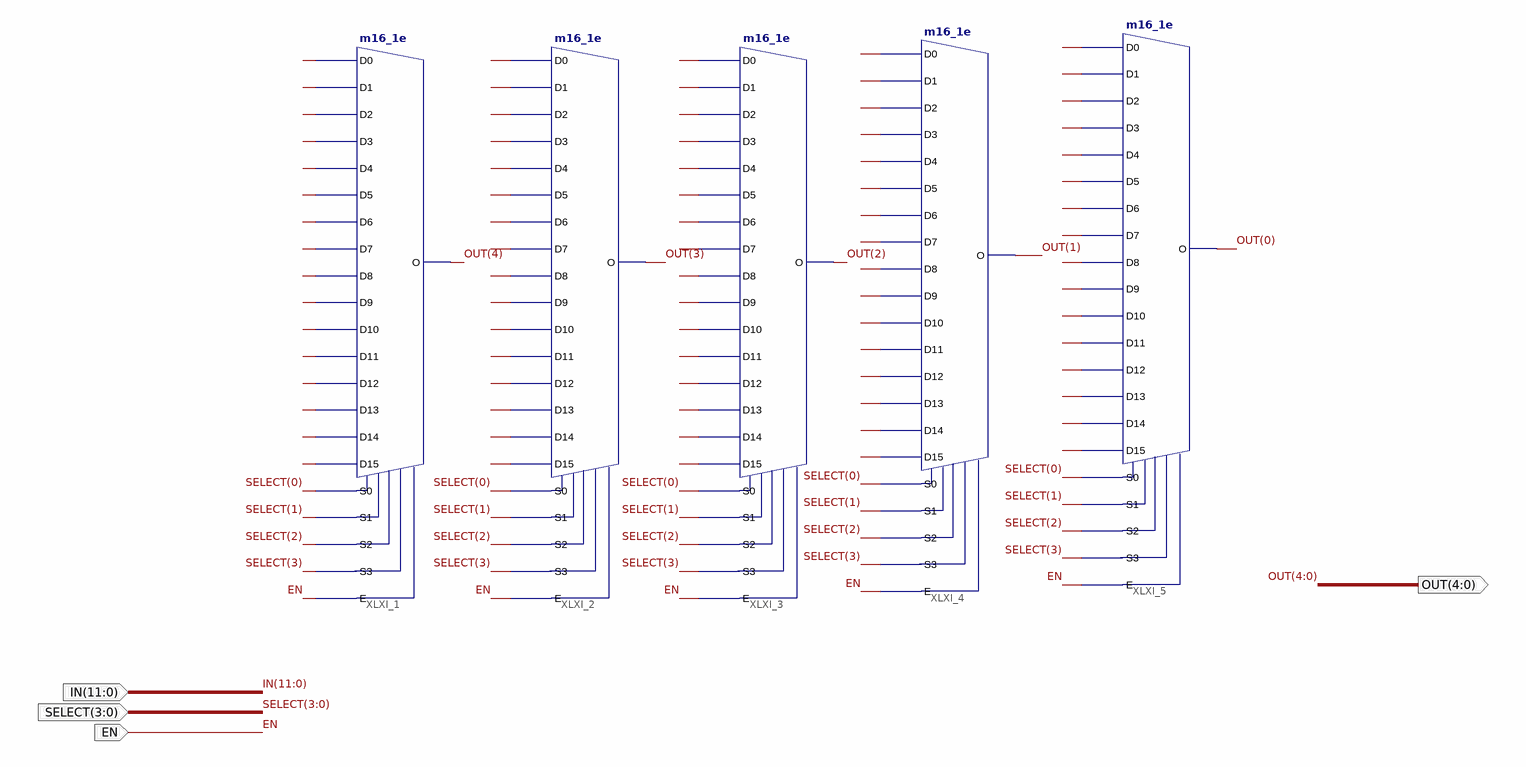
[diagram p0: schematic sheet 1]
// Xilinx ISE schematic eleven_five_mux.sch (spartan3e) as structural Verilog: 5 symbols, 4 ports
module eleven_five_mux (
  input  [3:0] SELECT,
  input  [11:0] IN,
  input  EN,
  output [4:0] OUT
);

  wire XLXN_10, XLXN_11, XLXN_12, XLXN_13, XLXN_14, XLXN_15, XLXN_16, XLXN_17, XLXN_18, XLXN_19, XLXN_21,
       XLXN_22, XLXN_23, XLXN_24, XLXN_25, XLXN_26, XLXN_33, XLXN_34, XLXN_35, XLXN_36, XLXN_37, XLXN_38,
       XLXN_39, XLXN_40, XLXN_41, XLXN_42, XLXN_43, XLXN_44, XLXN_45, XLXN_46, XLXN_47, XLXN_48, XLXN_58,
       XLXN_59, XLXN_60, XLXN_61, XLXN_62, XLXN_63, XLXN_64, XLXN_65, XLXN_66, XLXN_67, XLXN_69, XLXN_70,
       XLXN_71, XLXN_72, XLXN_73, XLXN_74, XLXN_75, XLXN_76, XLXN_77, XLXN_78, XLXN_79, XLXN_80, XLXN_81,
       XLXN_82, XLXN_83, XLXN_84, XLXN_85, XLXN_86, XLXN_87, XLXN_88, XLXN_89, XLXN_90, XLXN_96, XLXN_97,
       XLXN_98, XLXN_99, XLXN_100, XLXN_101, XLXN_102, XLXN_103, XLXN_106, XLXN_107, XLXN_108, XLXN_109,
       XLXN_110, XLXN_111, XLXN_112, XLXN_113;

  m16_1e XLXI_1 (
    .D0(XLXN_10), .D1(XLXN_11), .D10(XLXN_21), .D11(XLXN_22), .D12(XLXN_23), .D13(XLXN_24), .D14(XLXN_25),
    .D15(XLXN_26), .D2(XLXN_12), .D3(XLXN_13), .D4(XLXN_14), .D5(XLXN_15), .D6(XLXN_16), .D7(XLXN_17),
    .D8(XLXN_18), .D9(XLXN_19), .E(EN), .S0(SELECT[0]), .S1(SELECT[1]), .S2(SELECT[2]), .S3(SELECT[3]),
    .O(OUT[4]));
  m16_1e XLXI_2 (
    .D0(XLXN_33), .D1(XLXN_34), .D10(XLXN_43), .D11(XLXN_44), .D12(XLXN_45), .D13(XLXN_46), .D14(XLXN_47),
    .D15(XLXN_48), .D2(XLXN_35), .D3(XLXN_36), .D4(XLXN_37), .D5(XLXN_38), .D6(XLXN_39), .D7(XLXN_40),
    .D8(XLXN_41), .D9(XLXN_42), .E(EN), .S0(SELECT[0]), .S1(SELECT[1]), .S2(SELECT[2]), .S3(SELECT[3]),
    .O(OUT[3]));
  m16_1e XLXI_3 (
    .D0(XLXN_74), .D1(XLXN_73), .D10(XLXN_63), .D11(XLXN_62), .D12(XLXN_61), .D13(XLXN_60), .D14(XLXN_59),
    .D15(XLXN_58), .D2(XLXN_72), .D3(XLXN_71), .D4(XLXN_70), .D5(XLXN_69), .D6(XLXN_67), .D7(XLXN_66),
    .D8(XLXN_65), .D9(XLXN_64), .E(EN), .S0(SELECT[0]), .S1(SELECT[1]), .S2(SELECT[2]), .S3(SELECT[3]),
    .O(OUT[2]));
  m16_1e XLXI_4 (
    .D0(XLXN_75), .D1(XLXN_76), .D10(XLXN_85), .D11(XLXN_86), .D12(XLXN_87), .D13(XLXN_88), .D14(XLXN_89),
    .D15(XLXN_90), .D2(XLXN_77), .D3(XLXN_78), .D4(XLXN_79), .D5(XLXN_80), .D6(XLXN_81), .D7(XLXN_82),
    .D8(XLXN_83), .D9(XLXN_84), .E(EN), .S0(SELECT[0]), .S1(SELECT[1]), .S2(SELECT[2]), .S3(SELECT[3]),
    .O(OUT[1]));
  m16_1e XLXI_5 (
    .D0(XLXN_96), .D1(XLXN_97), .D10(XLXN_108), .D11(XLXN_109), .D12(XLXN_110), .D13(XLXN_111),
    .D14(XLXN_112), .D15(XLXN_113), .D2(XLXN_98), .D3(XLXN_99), .D4(XLXN_100), .D5(XLXN_101), .D6(XLXN_102),
    .D7(XLXN_103), .D8(XLXN_106), .D9(XLXN_107), .E(EN), .S0(SELECT[0]), .S1(SELECT[1]), .S2(SELECT[2]),
    .S3(SELECT[3]), .O(OUT[0]));
endmodule
